# EAGLE design casagrande_v1 (EAGLE 9.0.0)
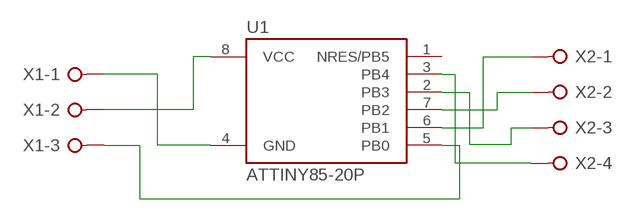
[diagram p0: schematic, sheet 1]

## Parts
U1  ATTINY85-20P  [PDIP08_300MIL]
X1  W237-03P  [W237-133]
X2  W237-04P  [W237-4P]

## Nets
2: U1.7(PB2) X2.2
3: U1.2(PB3) X2.3
4: U1.3(PB4) X2.4
BTN: U1.5(PB0) X1.3
GND: U1.4(GND) X1.1
N$1: U1.6(PB1) X2.1
VCC: U1.8(VCC) X1.2
Unconnected: U1.1(NRES/PB5)

## Library data of the parts
U1 = _hhn_attiny25_45_85:ATTINY85*: ATMEL ATtiny 85 Packages: P = PDIP 08 30mil S = SOIC 08 EIAJ 208mil Technologies Note: for complete ordering code (temp. range, finish, tape&reel etc.) see www.atmel.com • Supply Voltage: V = (1.8…5.5)V | [blank] = (2.7…5.5)V • Speed: 10 = 10 MHz | 20 = 20 MHz Author: Dipl.-Ing. FH Rainer Bayer HHN Hochschule Heilbronn (Heilbronn University), rainer.bayer@hs-heilbronn.de Ingenieurbüro ing-rb, mail@ing-rb.de
X1 = con-wago-508:W237-03P: WAGO SREW CLAMP; OC_FARNELL: unknown; OC_NEWARK: unknown
X2 = con-wago-508:W237-04P: WAGO SREW CLAMP; OC_FARNELL: unknown; OC_NEWARK: unknown

## Board
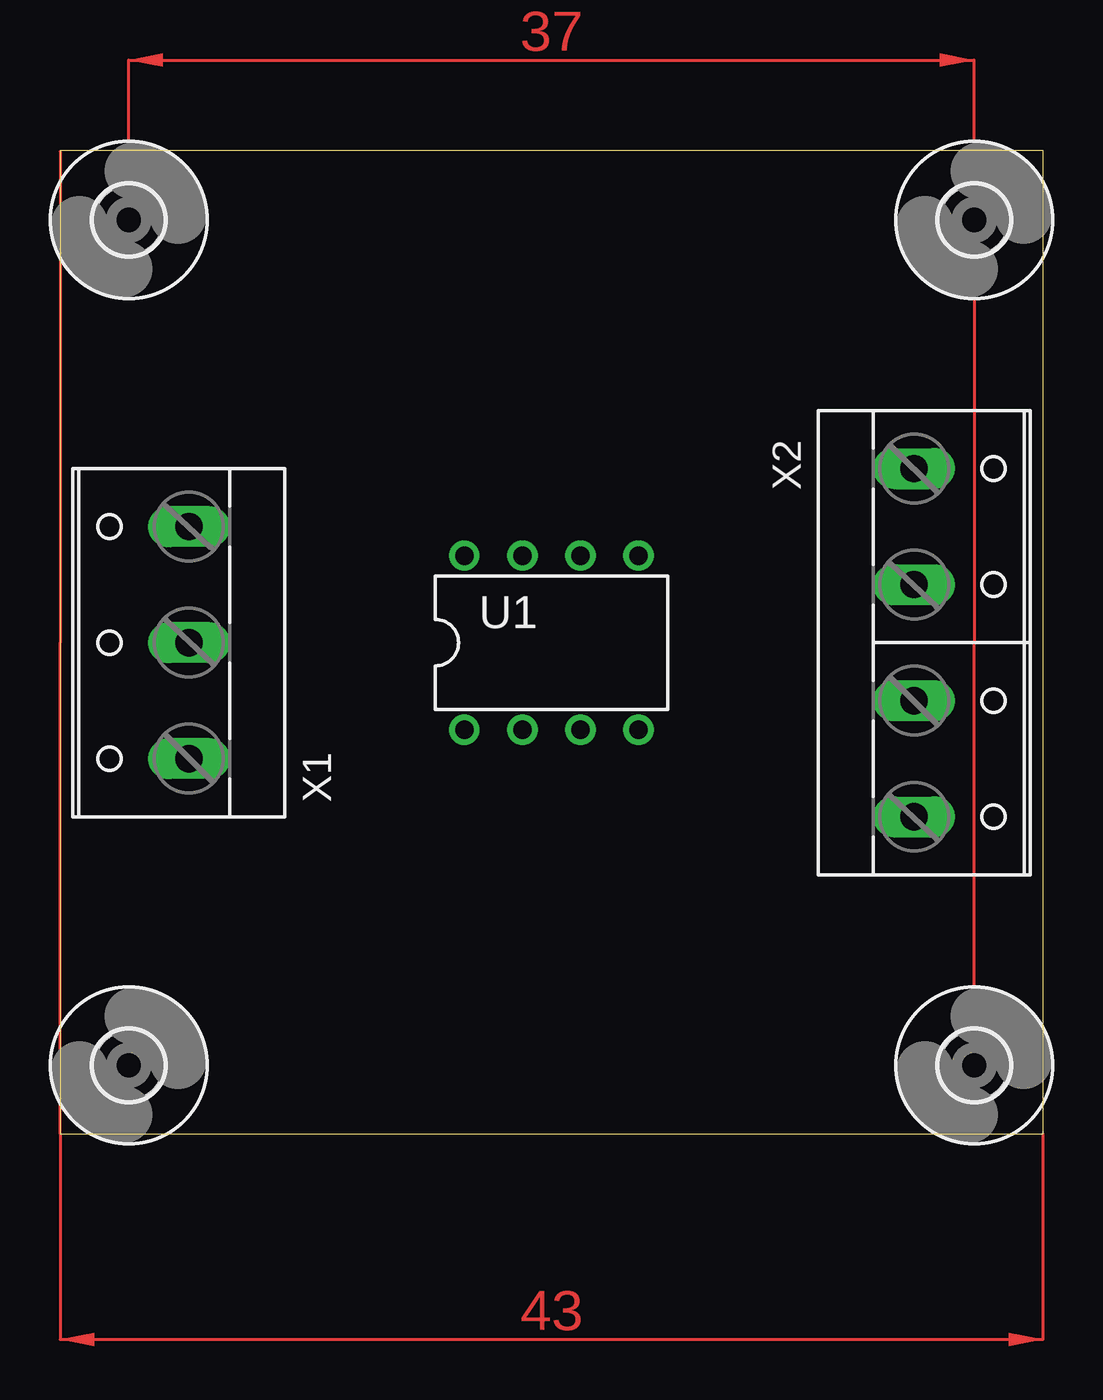
[diagram p1: board, top side]
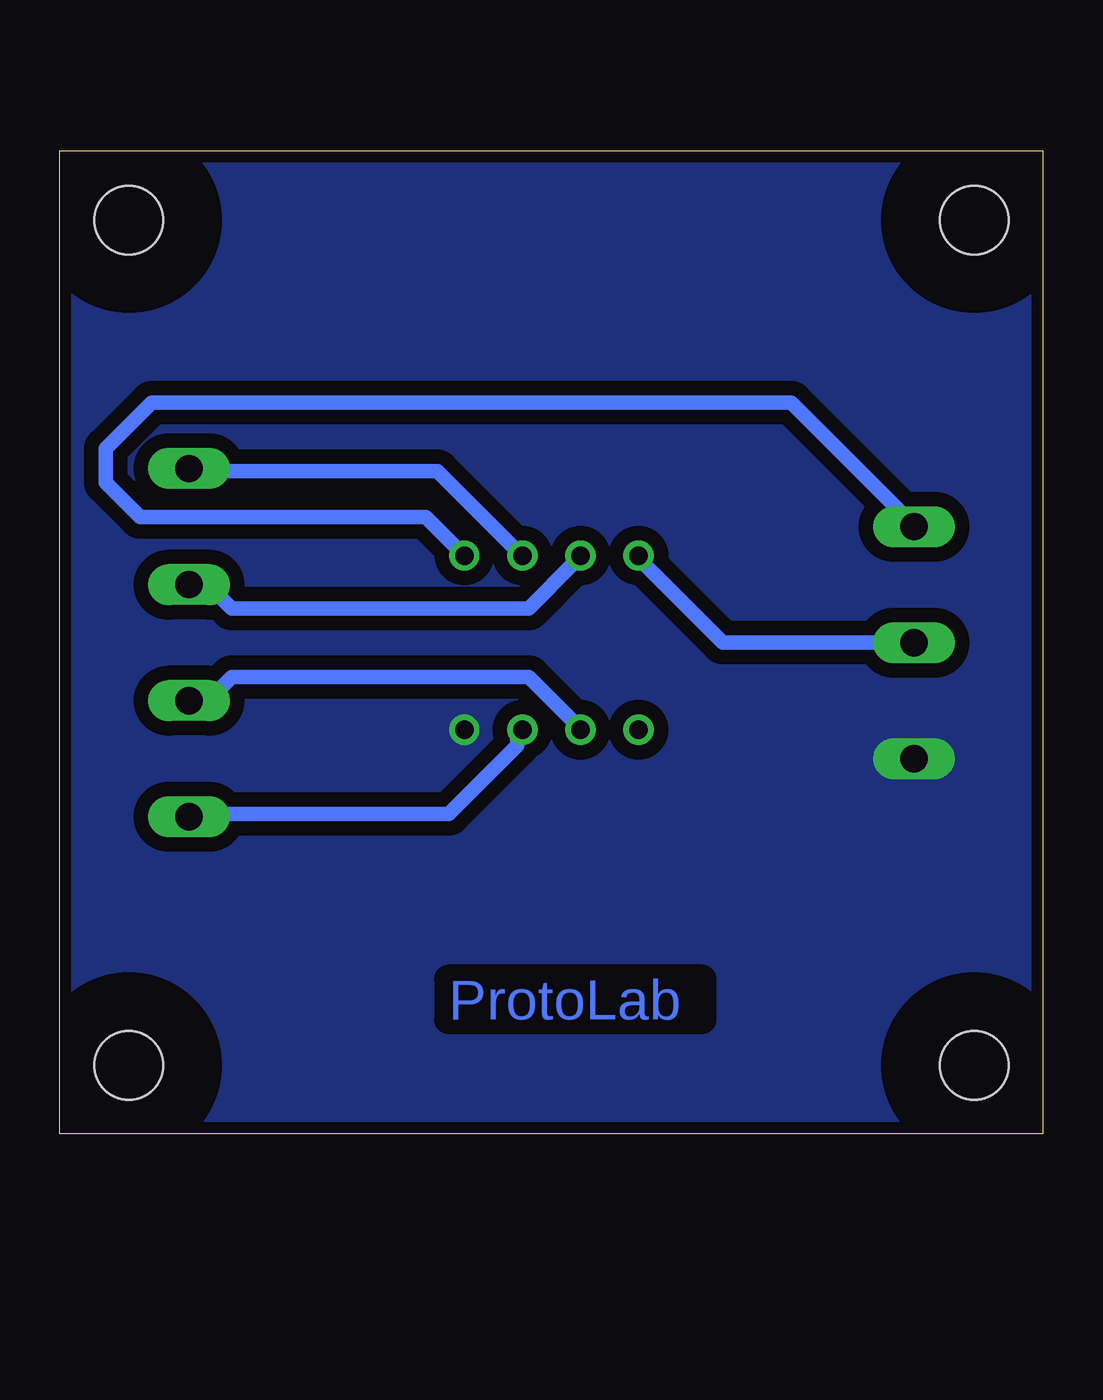
[diagram p2: board, bottom side, seen from below]

Size 43.02 x 43.04 mm. Coordinates in mm from the lower left corner, seen from the top.
Outline: 0,0 43.02,0 43.02,43.04 0,43.04 0,0
Copper layers (1*16): Top 0.035mm / dielectric 1.5mm / Bottom 0.035mm
Design rules "default *": minimum track width 25mil, minimum drill 0.6mm, track to track 25mil, track to pad 24mil, pad to pad 20mil, via to via 20mil, smd to smd 20mil, copper to edge 20mil, drill to drill 20mil, minimum pad ring 10mil, minimum via ring 8mil, stop-mask expansion 4mil, vias tented up to drill 0mil, thermal gap 0mil

### Footprints (pad centres in the part's own frame; a part is rotated, then mirrored left to right if it is on the bottom)
PDIP08_300MIL = drill 0.813: 1 -3.81,-3.81; 2 -1.27,-3.81; 3 1.27,-3.81; 4 3.81,-3.81; 5 3.81,3.81; 6 1.27,3.81; 7 -1.27,3.81; 8 -3.81,3.81
3,0 = hole 3: 0,0
W237-133 = drill 1.194 long: 1 -5.08,-0.635; 2 0,-0.635; 3 5.08,-0.635
W237-4P = drill 1.194 long: 1 -7.62,-0.635; 2 -2.54,-0.635; 3 2.54,-0.635; 4 7.62,-0.635

### Placement (x,y rotation side)
U1  21.5,21.5 0 top
U$1  [3,0]  3,40 0 top
U$2  [3,0]  3,3 0 top
U$3  [3,0]  40,3 0 top
U$4  [3,0]  40,40 0 top
X1  5,21.5 90 top
X2  38,21.5 270 top

### Tracks (layer width: path | path; a pad name or v marks a point on that pad's centre or on a via)
2
  Bottom 0.635: U1.7 20.5,25 22.5,23 35.5,23 37,24.5 X2.2
3
  Bottom 0.635: U1.2 20.5,18 22.5,20 35.5,20 37,18.5 X2.3
4
  Bottom 0.635: U1.3 23,17.5 23,17 26,14 37,14 X2.4
BTN
  Bottom 0.635: U1.5 27,27 39.5,27 41,28.5 41,30 39,32 11,32 6,27 X1.3
GND
  pour Bottom: 0,0 43.04,0 43.04,43 0,43
N$1
  Bottom 0.635: U1.6 23,25.5 26.5,29 37,29 X2.1
VCC
  Bottom 0.635: X1.2 14,21.5 17.5,25 U1.8
(copper drawn outside any net)
  shapes: Top area x4

### Text on the board
Bottom: ProtoLab